# EAGLE design control-board-v1-fix (EAGLE 6.4)
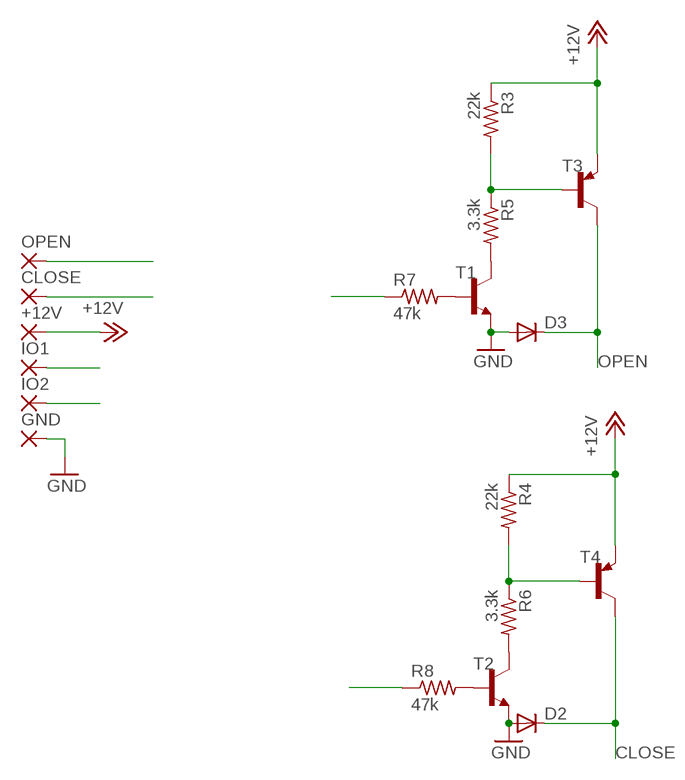
[diagram p0: schematic, sheet 1]

## Parts
+12V  1,6/0,8  [1,6/0,8]
CLOSE  1,6/0,8  [1,6/0,8]
D2  DIODE-MICROMELF-W  [MICROMELF-W]
D3  DIODE-MICROMELF-W  [MICROMELF-W]
GND  1,6/0,8  [1,6/0,8]
IO1  1,6/0,8  [1,6/0,8]
IO2  1,6/0,8  [1,6/0,8]
OPEN  1,6/0,8  [1,6/0,8]
R3  22k  R-US_R0603  [R0603]
R4  22k  R-US_R0603  [R0603]
R5  3.3k  R-US_R0603  [R0603]
R6  3.3k  R-US_R0603  [R0603]
R7  47k  R-US_R0603  [R0603]
R8  47k  R-US_R0603  [R0603]
T1  BC808-NPN-SOT23-BEC  [SOT23-BEC]
T2  BC808-NPN-SOT23-BEC  [SOT23-BEC]
T3  BC807-16-PNP-SOT23-BEC  [SOT23-BEC]
T4  BC807-16-PNP-SOT23-BEC  [SOT23-BEC]

## Nets
+12V: +12V.1(P) R3.1 R4.1 T3.E T4.E
CLOSE: CLOSE.1(P) D2.C T4.C
GND: D2.A D3.A GND.1(P) T1.E T2.E
IO1: IO1.1(P) R7.1
IO2: IO2.1(P) R8.1
N$6: R4.2 R6.1 T4.B
N$8: R3.2 R5.1 T3.B
N$10: R7.2 T1.B
N$11: R8.2 T2.B
N$12: R5.2 T1.C
N$13: R6.2 T2.C
OPEN: D3.C OPEN.1(P) T3.C

## Library data of the parts
+12V CLOSE GND IO1 IO2 OPEN = wirepad:1,6/0,8: THROUGH-HOLE PAD
D2 D3 = diode:DIODE-: DIODE
R3-R8 = adafruit:R-US_: RESISTOR, American symbol
T1 T2 = transistor:*-NPN-: NPN Transistror BF959 corrected 2008.03.06
T3 T4 = transistor:*-PNP-: PNP Transistror

## Board
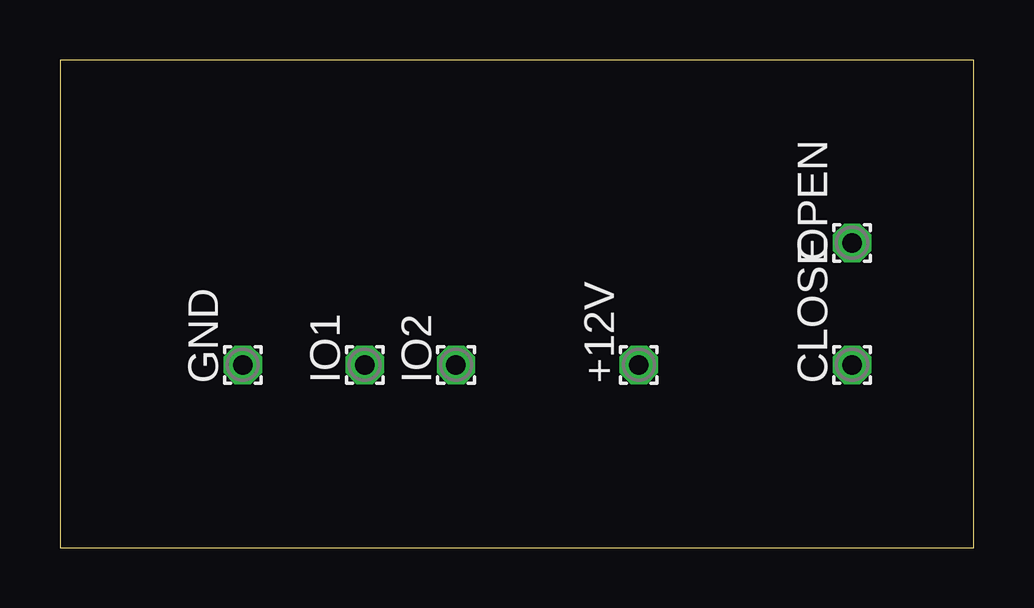
[diagram p1: board, top side]
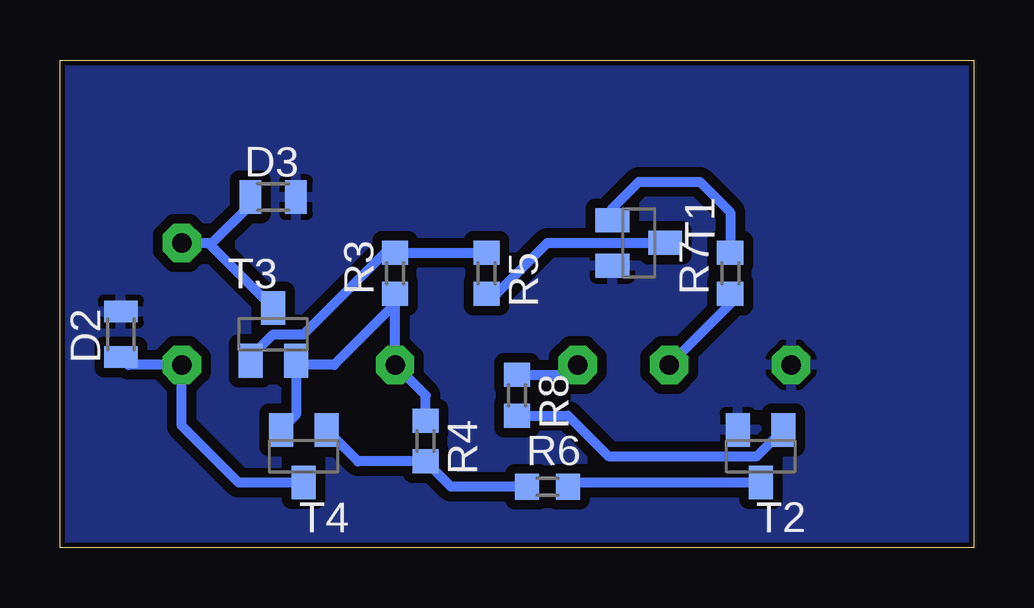
[diagram p2: board, bottom side, seen from below]

Size 38.1 x 20.32 mm. Coordinates in mm from the lower left corner, seen from the top.
Outline: 38.1,0 38.1,20.32 0,20.32 0,0 38.1,0
Copper layers (1*16): Top 0.035mm / dielectric 1.5mm / Bottom 0.035mm
Design rules "default *": minimum track width 10mil, minimum drill 24mil, track to track 16mil, track to pad 16mil, pad to pad 16mil, via to via 16mil, smd to smd 16mil, copper to edge 8mil, drill to drill 8mil, minimum pad ring 10mil, minimum via ring 8mil, stop-mask expansion 4mil, vias tented up to drill 0mil, thermal gap 10mil

### Footprints (pad centres in the part's own frame; a part is rotated, then mirrored left to right if it is on the bottom)
1,6/0,8 = drill 0.813 pad 1.6 octagon: 1 0,0
MICROMELF-W = smd 0.9 x 1.4: A 0.95,0; C -0.95,0
R0603 = smd 1 x 1.1: 1 -0.85,0; 2 0.85,0
SOT23-BEC = smd 1 x 1.4: B -0.95,-1.1; C 0,1.1; E 0.95,-1.1

### Placement (x,y rotation side)
+12V  24.13,7.62 90 top
CLOSE  33.02,7.62 90 top
D2  35.56,8.89 90 bottom
D3  29.21,14.61 0 bottom
GND  7.62,7.62 90 top
IO1  12.7,7.62 90 top
IO2  16.51,7.62 90 top
OPEN  33.02,12.7 90 top
R3  24.13,11.43 90 bottom
R4  22.86,4.45 270 bottom
R5  20.32,11.43 270 bottom
R6  17.78,2.54 0 bottom
R7  10.16,11.43 90 bottom
R8  19.05,6.35 270 bottom
T1  13.97,12.7 270 bottom
T2  8.89,3.81 180 bottom
T3  29.21,8.89 0 bottom
T4  27.94,3.81 180 bottom

### Tracks (layer width: path | path; a pad name or v marks a point on that pad's centre or on a via)
+12V
  Bottom 0.406: T4.E 28.26,5.54 T3.E 28.09,7.62 26.67,7.62 24.13,10.16 R3.1 +12V.1 22.86,6.35 R4.1
CLOSE
  Bottom 0.406: T4.C 30.65,2.71 33.02,5.08 CLOSE.1 35.24,7.62 D2.C
GND
  pour Bottom: 0,20.32 0,0 38.1,0 38.1,20.32
IO1
  Bottom 0.406: R7.1 10.16,10.16 IO1.1
IO2
  Bottom 0.406: R8.1 16.93,7.2 IO2.1
N$6
  Bottom 0.406: R6.1 21.8,2.54 R4.2 25.68,3.6 T4.B
N$8
  Bottom 0.406: T3.B 30.16,7.94 29.21,8.89 27.94,8.89 24.55,12.28 R3.2 R5.1
N$10
  Bottom 0.406: T1.B 15.07,14.14 13.97,15.24 11.43,15.24 10.16,13.97 R7.2
N$11
  Bottom 0.406: R8.2 16.93,5.5 15.24,3.81 9.04,3.81 T2.B
N$12
  Bottom 0.406: R5.2 19.9,10.58 17.78,12.7 T1.C
N$13
  Bottom 0.406: T2.C 16.76,2.71 R6.2
OPEN
  Bottom 0.406: OPEN.1 31.92,12.7 31.84,12.62 | 31.84,12.62 T3.C | D3.C 30.16,14.29 31.84,12.62